# EAGLE design power (EAGLE 9.2.2)
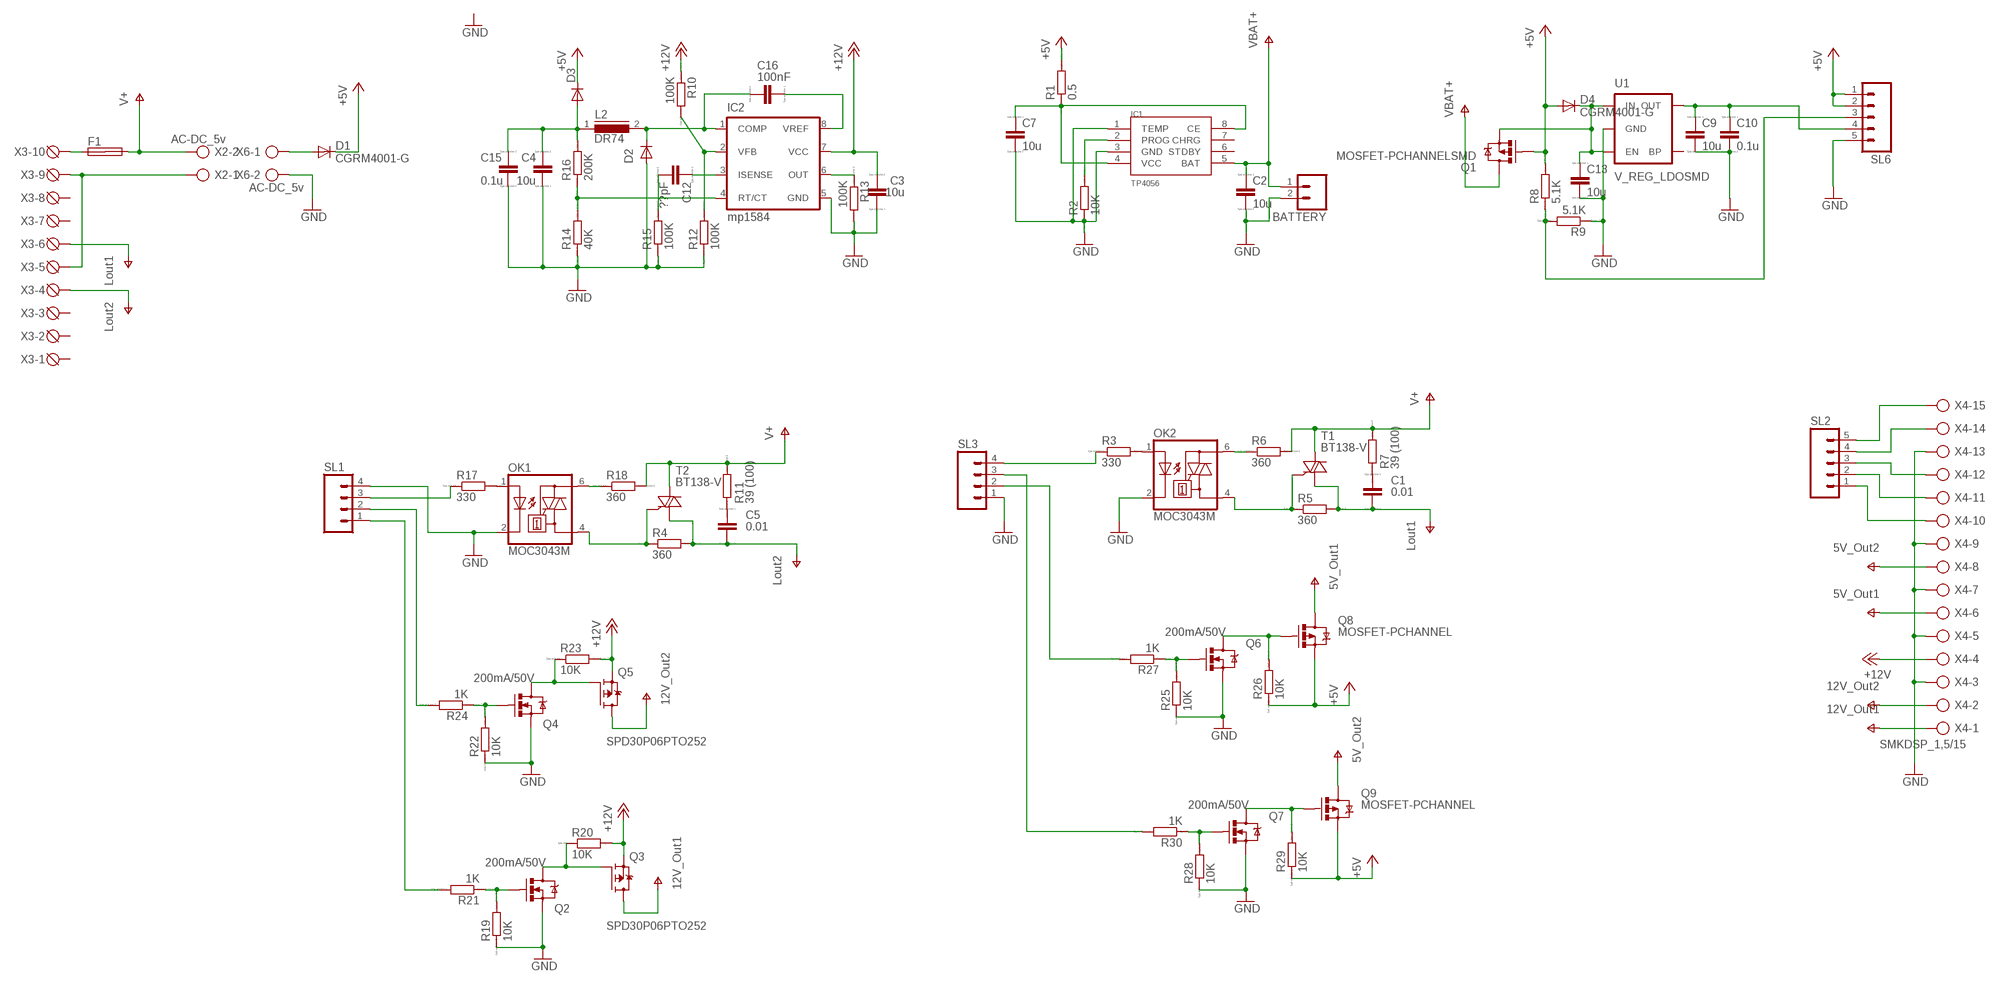
[diagram p0: schematic, sheet 1]

## Parts
BATTERY  M02  [02P]
C1  0.01  C-EU075-032X103  [C075-032X103]
C2  10u  C-EUC0805  [C0805]
C3  10u  C-EUC1206  [C1206]
C4  10u  C-EUC1206  [C1206]
C5  0.01  C-EU075-032X103  [C075-032X103]
C7  10u  C-EUC0805  [C0805]
C9  10u  C-EUC0805  [C0805]
C10  0.1u  C-EUC0805  [C0805]
C12  ??pF  C-EUC0603  [C0603]
C13  10u  C-EUC0805  [C0805]
C15  0.1u  C-EUC0805  [C0805]
C16  100nF  C-EUC0603  [C0603]
D1  CGRM4001-G  [SOD-123_MINI-SMA]
D2  ES2D  [SMB]
D3  CGRM4001-G  [SOD-123_MINI-SMA]
D4  CGRM4001-G  [SOD-123_MINI-SMA]
F1  SHK20L  [SHK20L]
IC1  TP4056  [SOP-8]
IC2  mp1584  UC3844D1  [SO-08]
L2  DR74  [DR74]
OK1  MOC3043M  [DIL06]
OK2  MOC3043M  [DIL06]
Q1  MOSFET-PCHANNELSMD  [SOT23-3]
Q2  200mA/50V  MOSFET-NCHANNELBSS138  [SOT23-3]
Q3  SPD30P06PTO252  [TO252]
Q4  200mA/50V  MOSFET-NCHANNELBSS138  [SOT23-3]
Q5  SPD30P06PTO252  [TO252]
Q6  200mA/50V  MOSFET-NCHANNELBSS138  [SOT23-3]
Q7  200mA/50V  MOSFET-NCHANNELBSS138  [SOT23-3]
Q8  MOSFET-PCHANNEL  [SOT23-3]
Q9  MOSFET-PCHANNEL  [SOT23-3]
R1  0.5  R-EU_R0805  [R0805]
R2  10K  R-EU_R0805  [R0805]
R3  330  R-EU_R1206  [R1206]
R4  360  R-EU_0204_7  [0204/7]
R5  360  R-EU_0204_7  [0204/7]
R6  360  R-EU_R1206  [R1206]
R7  39 (100)  R-EU_0411_12  [0411/12]
R8  5.1K  R-EU_R0805  [R0805]
R9  5.1K  R-EU_R0805  [R0805]
R10  100K  R-EU_R0603  [R0603]
R11  39 (100)  R-EU_0411_12  [0411/12]
R12  100K  R-EU_R0603  [R0603]
R13  100K  R-EU_R0603  [R0603]
R14  40K  R-EU_R0603  [R0603]
R15  100K  R-EU_R0603  [R0603]
R16  200K  R-EU_R0603  [R0603]
R17  330  R-EU_R1206  [R1206]
R18  360  R-EU_R1206  [R1206]
R19  10K  R-EU_R0805  [R0805]
R20  10K  R-EU_R0805  [R0805]
R21  1K  R-EU_R0805  [R0805]
R22  10K  R-EU_R0805  [R0805]
R23  10K  R-EU_R0805  [R0805]
R24  1K  R-EU_R0805  [R0805]
R25  10K  R-EU_R0805  [R0805]
R26  10K  R-EU_R0805  [R0805]
R27  1K  R-EU_R0805  [R0805]
R28  10K  R-EU_R0805  [R0805]
R29  10K  R-EU_R0805  [R0805]
R30  1K  R-EU_R0805  [R0805]
SL1  M04  [04P]
SL2  M05  [05P]
SL3  M04  [04P]
SL6  M05  [05P]
T1  BT138-V  [TO220BV]
T2  BT138-V  [TO220BV]
U1  V_REG_LDOSMD  [SOT23-5]
X2  AC-DC_5v  AK300/2  [AK300/2]
X3  DG3XX-10  [DG129-7.5-10P]
X4  SMKDSP_1,5/15  [SMKDSP_1,5/15]
X6  AC-DC_5v  AK300/2  [AK300/2]

## Nets
5V_OUT1: Q8.3(D) X4.6 ; supply symbol labelled 5V_Out1
5V_OUT2: Q9.3(D) X4.8 ; supply symbol labelled 5V_Out2
12V_OUT1: Q3.3(D) X4.1 ; supply symbol labelled 12V_Out1
12V_OUT2: Q5.3(D) X4.2 ; supply symbol labelled 12V_Out2
+5V: D1.C D3.C D4.A Q1.1(G) Q8.2(S) Q9.2(S) R1.2 R8.2 R26.1 R29.1 SL6.1 SL6.2
+12V: C3.2 IC2.7(VCC) Q3.2(S) Q5.2(S) R10.1 R20.2 R23.2 X4.4
GND: BATTERY.2 C2.2 C3.1 C4.1 C7.2 C9.2 C10.2 C13.2 C15.2 D2.A IC1.1(TEMP) IC1.3(GND) IC2.5(GND) OK1.2(C) OK2.2(C) Q2.2(S) Q4.2(S) Q6.2(S) Q7.2(S) R2.1 R9.1 R12.1 R13.2 R14.1 R15.1 R19.1 R22.1 R25.1 R28.1 SL1.4 SL3.1 SL6.5 U1.2(GND) X4.3 X4.5 X4.7 X4.9 X4.13 X6.2
LOUT1: C1.2 R5.2 T1.T1(A1) X3.6 ; supply symbol labelled Lout1
LOUT2: C5.2 R4.2 T2.T1(A1) X3.4 ; supply symbol labelled Lout2
N$1: OK2.4(A1) R5.1 T1.G
N$2: IC1.2(PROG) R2.2
N$3: C7.1 IC1.4(VCC) IC1.8(CE) R1.1
N$4: OK2.6(A2) R6.1
N$5: C9.1 C10.1 SL6.4 U1.5(OUT)
N$6: X2.1 X3.5 X3.9
N$7: F1.1A X3.10
N$8: R30.2 SL3.3
N$9: OK1.4(A1) R4.1 T2.G
N$10: C1.1 R7.1
N$11: D1.A X6.1
N$13: C13.1 D4.C Q1.2(S) U1.1(IN) U1.3(EN)
N$14: R8.1 R9.2 SL6.3
N$15: OK2.1(A) R3.2
N$16: R27.2 SL3.2
N$21: IC2.2(VFB) R10.2 R12.2
N$22: IC2.6(OUT) R13.1
N$23: IC2.4(RT/CT) R14.2 R16.1
N$24: C12.2 R15.2
N$25: C12.1 IC2.3(ISENSE)
N$26: C16.1 IC2.8(VREF)
N$27: C5.1 R11.1
N$28: Q2.3(D) Q3.1(G) R20.1
N$29: C4.2 C15.1 D3.A L2.1 R16.2
N$30: C16.2 D2.C IC2.1(COMP) L2.2
N$31: R17.1 SL1.3
N$32: Q6.3(D) Q8.1(G) R26.2
N$33: OK1.1(A) R17.2
N$34: SL2.1 X4.10
N$35: OK1.6(A2) R18.1
N$36: Q2.1(G) R19.2 R21.1
N$37: Q4.3(D) Q5.1(G) R23.1
N$38: Q4.1(G) R22.2 R24.1
N$39: Q6.1(G) R25.2 R27.1
N$40: Q7.1(G) R28.2 R30.1
N$41: Q7.3(D) Q9.1(G) R29.2
N$42: R24.2 SL1.2
N$43: R21.2 SL1.1
N$44: R3.1 SL3.4
N$45: SL2.2 X4.11
N$46: SL2.3 X4.12
N$47: SL2.4 X4.14
N$48: SL2.5 X4.15
V+: F1.2A R6.2 R7.2 R11.2 R18.2 T1.T2(A2) T2.T2(A2) X2.2
VBAT: BATTERY.1 C2.1 IC1.5(BAT) Q1.3(D) ; supply symbol labelled VBAT+
Unconnected: F1.1B F1.2B IC1.6(STDBY) IC1.7(CHRG) U1.4(BP) X3.1 X3.2 X3.3 X3.7 X3.8

## Library data of the parts
BATTERY = con-amp-quick:M02: AMP QUICK CONNECTOR; OC_FARNELL: unknown; OC_NEWARK: unknown
C1-C5 C7 C9 C10 C12 C13 C15 C16 = resistor:C-EU: CAPACITOR, European symbol; SPICEPREFIX: C
D1 D3 D4 = diode:CGRM400*-G: Molded plasitc,JEDEC SOD-123/Mini SMA Source: Comchip CGRM4001-G.pdf
D2 = diode:ES2D: DIODE super fast rectifier, 2 A
F1 = fuse:SHK20L: FUSE HOLDER 5 x 20 mm, SH contact, SHH1 Schukat, E1073 Buerklin; OC_FARNELL: unknown; OC_NEWARK: unknown
IC1 = TP4056:TP4056
IC2 = v-reg:UC384*: SMPS Controller Source: http://www.fairchildsemi.com/ds/UC/UC3843.pdf
L2 = inductors:DR74: High Power Density, High Efficiency, Shielded Inductors Source: coiltronics_dr_series.pdf
OK1 OK2 = optocoupler:MOC30*: 6-Pin DIP Zero-Cross Optoisolators Triac Driver Output (250/400 Volt Peak) Source: http://www.fairchildsemi.com/ds/MO/MOC3043-M.pdf; MF: FAIRCHILD SEMICONDUCTOR; MPN: MOC3043-M; OC_FARNELL: 1021371; OC_NEWARK: 72K8900
Q1 = SparkFun:MOSFET-PCHANNEL
Q2 Q4 Q6 Q7 = SparkFun-DiscreteSemi:MOSFET-NCHANNEL: Common NMOSFET Parts MFG P/N Store ID Prod ID FDD8780 TRANS-09984 SI7820DN TRANS-11055 FDS6630A IC-08089 2N7002PW TRANS-11151 FQP30N06L COM-10213 TRANS-10060 BSS123LT1G TRANS-08345 BSS138 TRANS-00830 BS170 2N7000; PROD_ID: TRANS-00830
Q3 Q5 = transistor-fet:SPD30P06P: SIPMOS(R) Power-Transistor P-Channel, Enhancement mode Source: http://www.infineon.com/upload/Document/cmc_upload/documents/012/3615/SPD_U30P06P.pdf
Q8 Q9 = SparkFun-DiscreteSemi:MOSFET-PCHANNEL: Generic PMOSFET IRLML2244 - TRANS-11153 (SOT-23 -20V -4.3A) (1.Gate 2.Source 3.Drain) FQP27P06 - COM-10349 <http://www.sparkfun.com/products/10349> (TO-220 -60V -27A) (1.Gate 2.Source 3.Drain); PROD_ID: TRANS-08285
R1-R30 = resistor:R-EU_: RESISTOR, European symbol; SPICEPREFIX: R
SL1 SL3 = con-amp-quick:M04: AMP QUICK CONNECTOR; OC_FARNELL: unknown; OC_NEWARK: unknown
SL2 SL6 = con-amp-quick:M05: AMP QUICK CONNECTOR; OC_FARNELL: unknown; OC_NEWARK: unknown
T1 T2 = triac:BT138: TRIAC Source: http://www.semiconductors.philips.com BT138_SERIES_2.pdf
U1 = SparkFun:V_REG_LDO: Voltage Regulator LDO Standard 150mA LDO voltage regulator in SOT-23 layout. Micrel part MIC5205. BP (by-pass) pin is used to lower output noise with 470pF cap.
X2 X6 = con-ptr500:AK300/2: CONNECTOR; OC_FARNELL: unknown; OC_NEWARK: unknown
X3 = degson:DG3XX-10: DG350-3.5-10P DG306-5.0-10P
X4 = con-phoenix-smkdsp:SMKDSP_1,5/15: Printklemme, Nennstrom: 17,5 A, Bemessungsspannung: 250 V, Raster: 5,0 mm Source: http://eshop.phoenixcontact.de .. 1733415.pdf; OC_FARNELL: unknown; OC_NEWARK: unknown

## Board
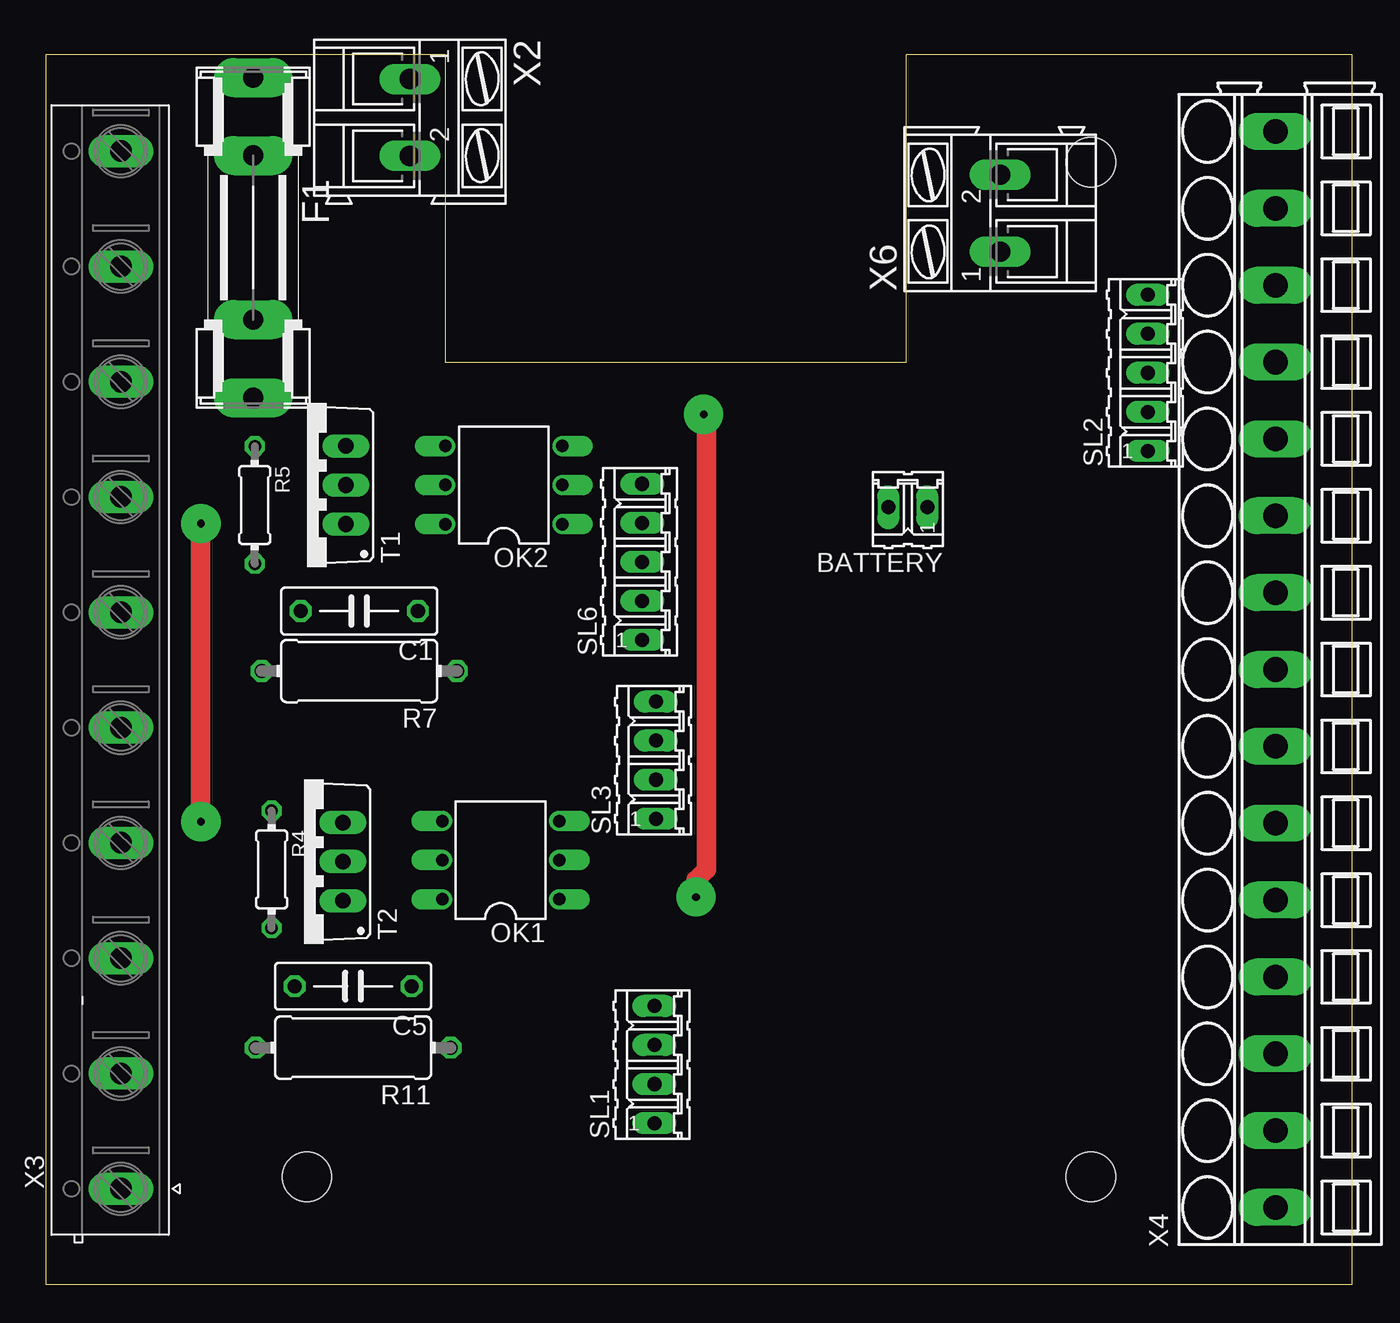
[diagram p1: board, top side]
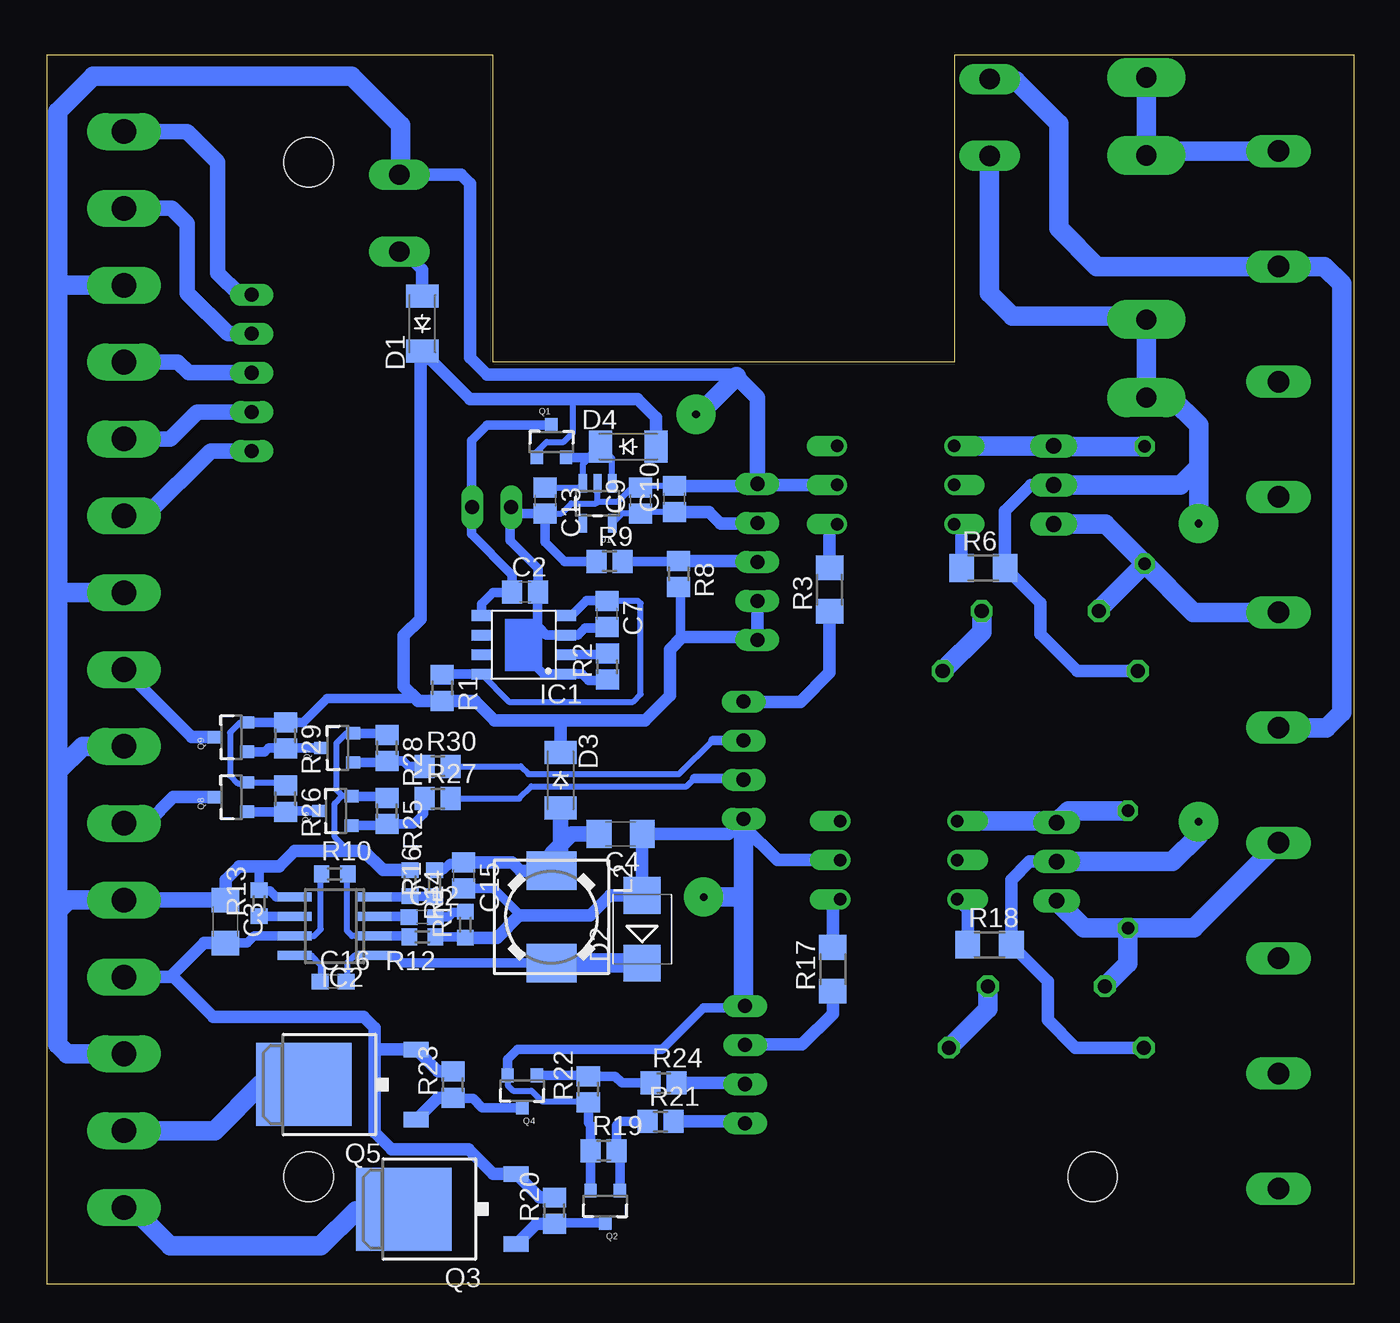
[diagram p2: board, bottom side, seen from below]

Size 85 x 80 mm. Coordinates in mm from the lower left corner, seen from the top.
Outline: 0,0 85,0 85,80 56,80 56,60 26,60 26,80 0,80 0,0
Copper layers (1*16): Top 0.035mm / dielectric 1.5mm / Bottom 0.035mm
Design rules "default": minimum track width 10mil, minimum drill 24mil, track to track 8mil, track to pad 8mil, pad to pad 8mil, via to via 8mil, smd to smd 8mil, copper to edge 40mil, drill to drill 8mil, minimum pad ring 10mil, minimum via ring 8mil, stop-mask expansion 4mil, vias tented up to drill 0mil, thermal gap 10mil
Holes 3.2 mm at 17,7 68,73 68,7

### Footprints (pad centres in the part's own frame; a part is rotated, then mirrored left to right if it is on the bottom)
02P = drill 0.914 long: 1 -1.27,0; 2 1.27,0
C075-032X103 = drill 0.914 octagon: 1 -3.81,0; 2 3.81,0
C0805 = smd 1.3 x 1.5: 1 -0.85,0; 2 0.85,0
C1206 = smd 1.6 x 1.8: 1 -1.4,0; 2 1.4,0
C0603 = smd 1.1 x 1: 1 -0.85,0; 2 0.85,0
SOD-123_MINI-SMA = smd 1.5 x 2.1: A 1.8,0; C -1.8,0
SMB = smd 2.4 x 2.4: A 2.2,0; C -2.2,0
SHK20L = drill 1.321 pad 2.54 long: 1A -10.414,0; 1B -5.334,0; 2A 10.414,0; 2B 5.334,0
SOP-8 = smd 1.3 x 0.7: 1 -2.75,1.905; 2 -2.75,0.635; 3 -2.75,-0.635; 4 -2.75,-1.905; 5 2.75,-1.905; 6 2.75,-0.635; 7 2.75,0.635; 8 2.75,1.905
SO-08 = smd 0.6 x 2.2: 1 -1.905,-2.6; 2 -0.635,-2.6; 3 0.635,-2.6; 4 1.905,-2.6; 5 1.905,2.6; 6 0.635,2.6; 7 -0.635,2.6; 8 -1.905,2.6
DR74 = smd 2.5 x 3.25: 1 -3,0; 2 3,0
DIL06 = drill 0.813 offset: 1 -2.54,-3.81; 2 0,-3.81; 3 2.54,-3.81; 4 2.54,3.81; 5 0,3.81; 6 -2.54,3.81
SOT23-3 = smd 0.8 x 0.9: 1 -0.95,-1; 2 0.95,-1; 3 0,1.1
TO252 = smd 1 x 1.6: 1 -2.28,-4.8; 2 2.28,-4.8 | smd 5.4 x 6.2: 3 0,2.5
R0805 = smd 1.3 x 1.5: 1 -0.85,0; 2 0.85,0
R1206 = smd 1.6 x 1.803: 1 -1.422,0; 2 1.422,0
0204/7 = drill 0.813 octagon: 1 -3.81,0; 2 3.81,0
0411/12 = drill 0.914 octagon: 1 -6.35,0; 2 6.35,0
R0603 = smd 1 x 1.1: 1 -0.85,0; 2 0.85,0
04P = drill 0.914 long: 1 -3.81,0; 2 -1.27,0; 3 1.27,0; 4 3.81,0
05P = drill 0.914 long: 1 -5.08,0; 2 -2.54,0; 3 0,0; 4 2.54,0; 5 5.08,0
TO220BV = drill 1.016 long: G 2.54,-2.54; T1 -2.54,-2.54; T2 0,-2.54
SOT23-5 = smd 0.55 x 1.2: 1 -0.95,-1.3; 2 0,-1.3; 3 0.95,-1.3; 4 0.95,1.3; 5 -0.95,1.3
AK300/2 = drill 1.321 long: 1 -2.515,0; 2 2.489,0
DG129-7.5-10P = drill 1.4 long: 1 3.02,3.11; 2 10.52,3.11; 3 18.02,3.11; 4 25.52,3.11; 5 33.02,3.11; 6 40.52,3.11; 7 48.02,3.11; 8 55.52,3.11; 9 63.02,3.11; 10 70.52,3.11
SMKDSP_1,5/15 = drill 1.6 pad 1.8 long: 1 -2.5,0; 2 2.5,0; 3 7.5,0; 4 12.5,0; 5 17.5,0; 6 22.5,0; 7 27.5,0; 8 32.5,0; 9 37.5,0; 10 42.5,0; 11 47.5,0; 12 52.5,0; 13 57.5,0; 14 62.5,0; 15 67.5,0

### Placement (x,y rotation side)
BATTERY  56.09,50.56 180 top
C1  20.4,43.8 180 top
C2  53.91,45.04 0 bottom
C3  73.4,23.6 270 bottom
C4  47.7,29.3 180 bottom
C5  20,19.4 180 top
C7  48.58,43.62 270 bottom
C9  46.4,51 90 bottom
C10  44.2,51.1 90 bottom
C12  60.6,23.9 0 bottom
C13  52.6,51 270 bottom
C15  57.9,26.6 270 bottom
C16  66.4,19.7 0 bottom
D1  60.6,62.5 90 bottom
D2  46.3,23.1 90 bottom
D3  51.6,32.8 270 bottom
D4  47.2,54.5 0 bottom
F1  13.5,68.1 270 top
IC1  54,41.6 180 bottom
IC2  66.3,23.3 90 bottom
L2  52.2,23.9 270 bottom
OK1  29.6,27.6 90 top
OK2  29.8,52 90 top
Q1  52.2,54.8 0 bottom
Q2  48.7,5.1 180 bottom
Q3  59.3,4.9 90 bottom
Q4  54.1,12.6 180 bottom
Q5  65.8,13 90 bottom
Q6  66.2,30.8 90 bottom
Q7  66.1,34.9 90 bottom
Q8  73,31.7 90 bottom
Q9  73,35.6 90 bottom
R1  59.3,38.81 270 bottom
R2  48.55,40.19 90 bottom
R3  34.1,45.2 90 bottom
R4  14.7,27 270 top
R5  13.6,50.7 270 top
R6  24.1,46.6 0 bottom
R7  20.4,39.9 180 top
R8  43.92,46.22 270 bottom
R9  48.42,47.03 0 bottom
R10  66.3,26.7 0 bottom
R11  20,15.4 180 top
R12  60.6,22.6 180 bottom
R13  71.2,24.8 90 bottom
R14  61.4,26.1 270 bottom
R15  57.8,23.4 90 bottom
R16  59.8,26.1 90 bottom
R17  33.9,20.5 90 bottom
R18  23.7,22.1 0 bottom
R19  48.8,8.7 0 bottom
R20  52,4.8 90 bottom
R21  45.1,10.6 0 bottom
R22  49.8,12.7 90 bottom
R23  58.6,13 90 bottom
R24  44.9,13.1 0 bottom
R25  62.9,30.8 270 bottom
R26  69.5,31.6 270 bottom
R27  59.6,31.6 0 bottom
R28  62.9,34.9 270 bottom
R29  69.5,35.7 270 bottom
R30  59.6,33.7 0 bottom
SL1  39.6,14.3 90 top
SL2  71.7,59.3 90 top
SL3  39.7,34.1 90 top
SL6  38.8,47 90 top
T1  17,52 90 top
T2  16.8,27.5 90 top
U1  49.2,50.8 180 bottom
X2  23.7,75.9 270 top
X3  8,3.2 90 top
X4  80,7.5 90 top
X6  62.1,69.7 90 top

### Tracks (layer width: path | path; a pad name or v marks a point on that pad's centre or on a via)
5V_OUT1
  Bottom 0.813: Q8.3 76.8,31.7 78.5,30 X4.6
5V_OUT2
  Bottom 0.813: Q9.3 75.6,35.6 X4.8
12V_OUT1
  Bottom 1.27: X4.1 79.5,5 77,2.5 67.2,2.5 64.9,4.8 61.9,4.8 Q3.3
12V_OUT2
  Bottom 1.27: Q5.3 71.1,13 74.1,10 X4.2 | X4.2 80.4,10 80.6,9.8 80.2,9.8 X4.2
+5V
  Bottom 0.406: R26.1 69.7,32.65 Q8.2 72.05,32.6 72.6,32.6 73.1,33.1 73.1,35.9 72.45,36.55 Q9.2 | Q1.1 53.15,54.15 52.5,54.8 51.4,54.8 50.8,55.4 50.8,57.5 50.9,57.6
  Bottom 0.61: R8.2 43.8,45.25 43.8,42.2 43.7,42.1 | 60.95,38.05 61,38.1 66.8,38.1 68.35,36.55 R29.1 Q9.2
  Bottom 0.813: D1.C 60.25,60.35 | 60.25,60.35 57.5,57.6 50.9,57.6 46.6,57.6 45.4,56.4 D4.A | 60.25,60.35 60.7,59.9 60.7,43.3 61.8,42.2 61.8,38.9 60.95,38.05 60.86,37.96 R1.2 57.16,37.96 55.9,36.7 51.8,36.7 | SL6.2 SL6.1 38.98,42.1 43.7,42.1 44.5,41.3 44.5,38.3 46.1,36.7 51.8,36.7 | D3.C 51.6,36.5 51.8,36.7
+12V
  Bottom 0.406: IC2.7 67.64,22.66 67.2,23.1 67.2,26.65 R10.1
  Bottom 0.61: IC2.7 71.53,22.66 72,22.2 C3.2
  Bottom 0.813: R23.2 59.57,13.85 Q5.2 63.68,15.28 63.7,15.3 | R20.2 52.97,5.65 Q3.2 55.98,7.18 57.6,8.8 62.6,8.8 63.7,9.9 63.7,15.3 | 63.7,15.3 63.7,16.7 64.4,17.4 74.2,17.4 76.8,20 77,20 | 77,20 X4.4 | C3.2 74.8,22.2 77,20
GND  (via drill 0.5 pad 2.54)
  Top 1.27: v42.3,25.2 42.3,26.3 43,27 43,56.4 v42.8,56.6
  Bottom 0.406: 49.2,50.9 47.9,50.9 46.95,51.85 C9.2 46.3,51.95 C10.2 | 49.2,50.9 U1.2 | C13.2 51.55,50.15 50.9,50.8 49.3,50.8 49.2,50.9 | Q7.2 65.55,35.85 66.2,35.2 66.2,32.2 65.8,31.8 | 65.8,31.8 65.25,31.8 Q6.2 | 64.4,28.2 65.4,28.2 66.3,29.1 66.3,31.3 65.8,31.8 | Q4.2 55.05,12.95 54.7,12.6 53.5,12.6 52.8,11.9 49.85,11.9 R22.1
  Bottom 0.61: 71.1,27.2 71.2,27.1 R13.2 71.15,25.6 70.5,25.6 70.11,25.2 IC2.5 | R12.1 57.85,22.6 R15.1 | C15.2 55.95,25.75 54.2,24 | R9.1 51.33,47.03 52.6,48.3 C13.2 54.41,50.15 BATTERY.2 54.9,50.48 54.9,48.4 53.06,46.56 C2.2 53.1,45 53.1,42.8 53.05,42.75 | Q4.2 55.05,14.65 54.4,15.3 45,15.3 42.3,18 39.71,18 SL1.4 | Q2.2 R19.1 49.65,10.35 49.8,10.5 R22.1 | R2.1 48.59,39.3 49.8,39.3 50.2,39.7 IC1.1 52.7,39.7 53.3,40.3 53.3,42.5 53.05,42.75 | C7.2 48.65,42.7 50,42.7 50.47,42.23 IC1.3 52.53,42.23 53.05,42.75 | Q7.2 63,35.85 R28.1 | Q6.2 63,31.75 R25.1
  Bottom 0.813: R14.1 63.15,26.95 64.4,28.2 68.9,28.2 69.9,27.2 71.1,27.2 72.5,27.2 73.4,26.3 C3.1 | R15.1 55.75,22.55 54.3,24 54.2,24 49.7,24 48.4,25.3 D2.A C4.1 40.69,29.3 SL3.1 | X6.2 58.09,72.19 57.5,71.6 57.5,60.3 56.4,59.2 40.3,59.2 40.15,59.05 40.1,59 39.7,58.6 | OK1.2 37.5,27.6 39.7,29.8 | OK2.2 38.72,52 SL6.5 38.93,51.95 C10.2
  Bottom 1.016: C3.1 X4.5 | SL6.5 38.8,57.7 40.1,59
  Bottom 1.27: X4.3 83.7,15 84.3,15.6 84.3,24.3 | 84.3,24.3 83.6,25 X4.5 | X4.7 82.7,35 84.3,33.4 | 84.3,33.4 84.3,24.3 | 84.3,65.3 84.3,76.3 82,78.6 65.2,78.6 62,75.4 62,72.29 X6.2 | 84.3,65.3 84.3,44.9 | 84.3,44.9 84.3,33.4 | SL3.1 39.7,29.8 39.7,25.5 | 39.7,25.5 39.7,18.21 SL1.4 | v42.8,56.6 42.6,56.6 40.15,59.05 | v42.3,25.2 40,25.2 39.7,25.5 | X4.13 84,65 84.3,65.3 | X4.9 84.2,45 84.3,44.9
LOUT1
  Bottom 1.27: T1.T1 16.17,49.46 R5.2 | R5.2 10.43,43.72 X3.6 | C1.2 16.59,43.9 R5.2
LOUT2
  Bottom 1.27: T2.T1 17.57,23.19 R4.2 | R4.2 10.42,23.19 X3.4 | C5.2 14.7,20.89 R4.2
N$1
  Bottom 1.27: OK2.4 T1.G 19.51,54.51 R5.1
N$2
  Bottom 0.61: IC1.2 48.62,40.97 R2.2
N$3
  Bottom 0.406: IC1.8 54.95,37.9 46.9,37.9 46.4,38.4 46.4,44.3 46.57,44.47 C7.1
  Bottom 0.61: IC1.8 59.27,39.7 R1.1 | IC1.4 50.9,43.51 49.9,44.5 48.61,44.5 C7.1
N$4
  Bottom 0.813: R6.1 25.52,48.99 OK2.6
N$5
  Bottom 0.406: C10.1 46.3,50.25 C9.1 47.6,50.15 U1.5
  Bottom 0.813: C10.1 41.95,50.25 41.2,49.5 38.84,49.5 SL6.4
N$6
  Bottom 1.27: X3.5 4.87,36.2 1.8,36.2 0.8,37.2 0.8,65.1 1.92,66.22 X3.9 16.72,66.22 19.2,68.7 19.2,75.5 22,78.3 23.59,78.3 X2.1
N$7
  Bottom 1.27: X3.10 13.02,73.72 13.5,74.2 F1.1A
N$8
  Bottom 0.406: R30.2 54.2,33.7 53.7,33.2 43.9,33.2 41.7,35.4 | 39.73,35.4 SL3.3
  Bottom 0.61: 41.7,35.4 39.73,35.4
N$9
  Bottom 1.27: OK1.4 19.44,30.14 T2.G 18.57,30.81 R4.1
N$10
  Bottom 1.27: C1.1 24.21,42.44 R7.1
N$11
  Bottom 0.813: X6.1 61.78,67.19 60.6,66 D1.A
N$13
  Bottom 0.406: C13.1 50.4,51.85 U1.3 50.15,53.35 49.55,53.95 D4.C 48.25,53.75 U1.1
  Bottom 0.61: Q1.2 49.7,53.8 49.55,53.95
N$14
  Bottom 0.61: R9.2 43.96,47.03 R8.1
  Bottom 0.813: R8.1 38.87,47.07 SL6.3
N$15
  Bottom 0.813: R3.2 34.1,48.97 OK2.1
N$16
  Bottom 0.406: R27.2 54.3,31.6 53.5,32.4 43.4,32.4 42.9,32.9 | 39.77,32.9 SL3.2
  Bottom 0.61: 42.9,32.9 39.77,32.9
N$17  (via drill 0.5)
  other vias: 17,7
N$18  (via drill 0.5)
  other vias: 68,7
N$20  (via drill 0.5)
  other vias: 68,73
N$21
  Bottom 0.406: IC2.2 65.17,22.66 65.5,23 65.5,26.65 R10.2
  Bottom 0.61: IC2.2 61.52,22.66 R12.2
N$22
  Bottom 0.61: IC2.6 71.19,23.93 R13.1
N$23
  Bottom 0.61: IC2.4 61.45,25.2 R14.2 R16.1
N$24
  Bottom 0.61: C12.2 58.9,23.9 58.6,24.2 57.85,24.2 R15.2
N$25
  Bottom 0.61: IC2.3 61.48,23.93 C12.1
N$26
  Bottom 0.406: IC2.8 67.8,21.39 67.2,20.8 67.2,19.75 C16.1
N$27
  Bottom 1.27: C5.1 23.81,17.94 R11.1
N$28
  Bottom 0.61: Q2.3 51.95,4 R20.1
  Bottom 0.813: R20.1 53.17,3.95 Q3.1
N$29
  Bottom 0.61: R16.2 59.25,26.95 58.8,27.4 57.95,27.4 C15.1
  Bottom 0.813: C15.1 54.75,27.45 54.2,26.9 L2.1
  Bottom 1.016: C4.2 50.9,29.3 52.2,28 52.2,27.6 | 52.2,27.6 L2.1 | D3.A 51.6,28.2 52.2,27.6
N$30
  Bottom 0.406: IC2.1 65,21.39 65.5,20.9 65.5,19.75 C16.2
  Bottom 0.61: IC2.1 62.4,21.39 61.9,20.9 L2.2
  Bottom 1.27: D2.C L2.2
N$31
  Bottom 0.813: R17.1 33.9,17.6 35.9,15.6 39.57,15.6 SL1.3
N$32
  Bottom 0.61: Q6.3 69.45,30.8 R26.2 Q8.1
N$33
  Bottom 0.813: R17.2 33.9,24.57 OK1.1
N$34
  Bottom 1.016: SL2.1 74.38,54.22 78.6,50 X4.10
N$35
  Bottom 0.813: R18.1 25.12,24.39 OK1.6
N$36
  Bottom 0.61: Q2.1 47.75,8.5 R19.2 47.95,10.35 47.7,10.6 R21.1
N$37
  Bottom 0.61: Q4.3 56.7,11.5 57.3,12.1 58.55,12.1 R23.1
  Bottom 0.813: R23.1 59.57,12.15 Q5.1
N$38
  Bottom 0.61: Q4.1 49.85,13.6 R22.2 48.05,13.55 47.6,13.1 R24.1
N$39
  Bottom 0.61: Q6.1 63,29.85 R25.2 61.15,29.95 60.5,30.6 60.5,31.55 R27.1
N$40
  Bottom 0.61: Q7.1 63,33.95 R28.2 61.85,34.05 61.5,33.7 R30.1
N$41
  Bottom 0.61: Q7.3 69.45,34.9 R29.2 69.55,34.9 70.6,34.9 70.85,34.65 Q9.1
N$42
  Bottom 0.813: R24.2 39.67,13.1 SL1.2
N$43
  Bottom 0.813: R21.2 39.71,10.6 SL1.1
N$44
  Bottom 0.813: R3.1 34.1,39.8 36,37.9 SL3.4
N$45
  Bottom 1.016: SL2.2 75.24,56.76 77,55 X4.11
N$46
  Bottom 1.016: SL2.3 75.8,59.3 76.5,60 X4.12
N$47
  Bottom 1.016: SL2.4 73.24,61.84 75.9,64.5 75.9,69 76.9,70 X4.14
N$48
  Bottom 1.016: SL2.5 72.48,64.38 73.9,65.8 73.9,73 75.9,75 X4.15
V+  (via drill 0.5 pad 2.54)
  Top 1.27: v10.1,49.5 v10.1,30.1
  Bottom 0.813: T2.T2 21.1,27.5 22.28,26.32 R18.2 19.9,19.72 19.9,17.2 18.1,15.4 R11.2 | T1.T2 21,52 22.7,50.3 22.7,46.62 R6.2 20.4,44.32 20.4,42.3 18,39.9 R7.2
  Bottom 1.27: 10.1,53.2 v10.1,49.5 | v10.1,30.1 10.1,29.2 11.8,27.5 T2.T2 | T1.T2 11.3,52 10.1,53.2 | 10.1,53.2 10.1,55.9 11.9,57.7 13.49,57.7 F1.2A 13.5,62.5 14,63 22.2,63 23.7,64.5 X2.2
VBAT
  Bottom 0.61: Q1.3 56.4,55.9 57.4,54.9 57.4,50.6 BATTERY.1 57.4,50.52 57.4,48.8 54.76,46.16 C2.1 54.8,45 56,45 56.75,44.25 IC1.5